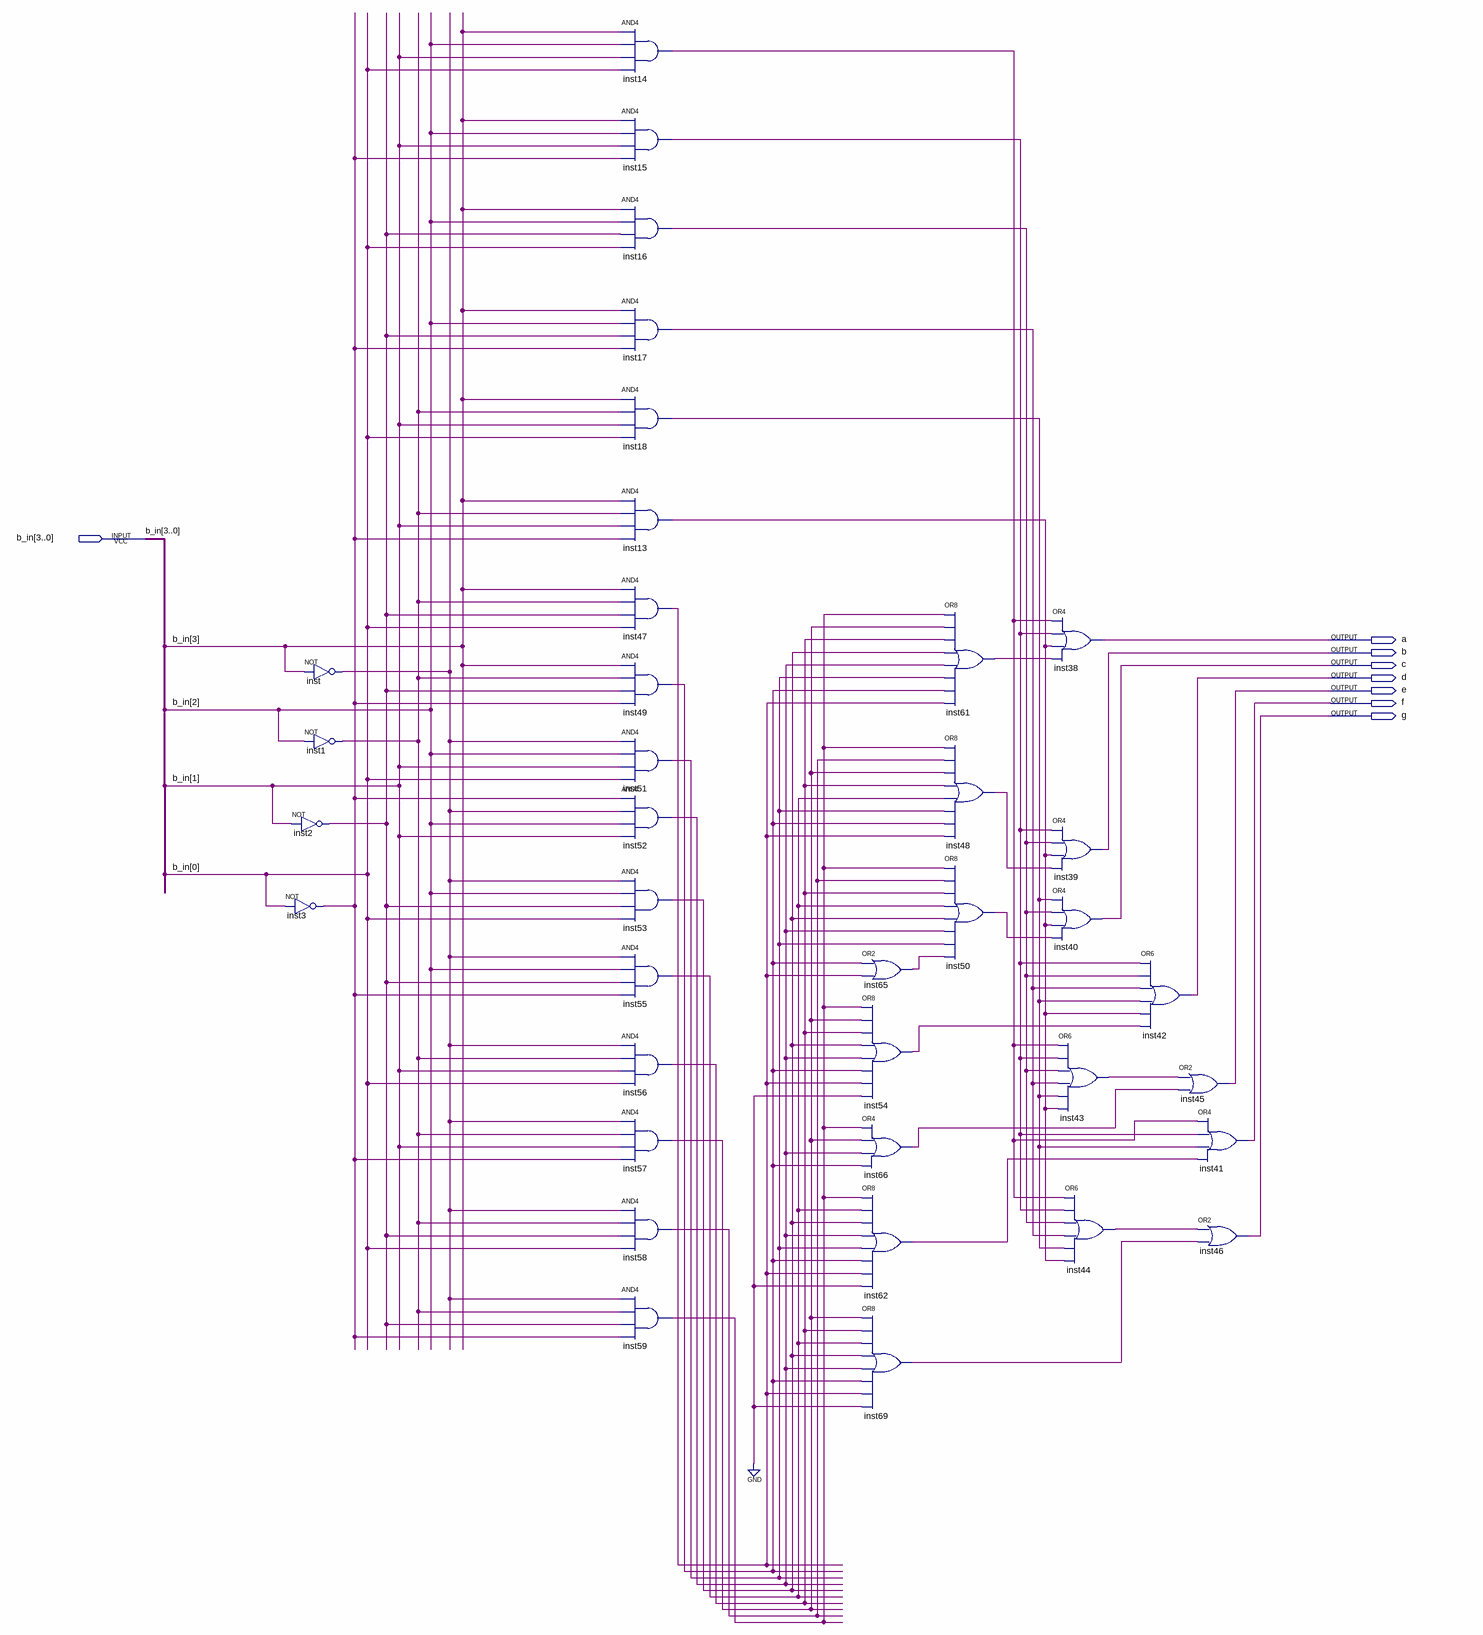
[diagram p0: schematic sheet]
// Quartus schematic b2seg_bus.bdf as structural Verilog: 37 symbols, 8 pins
module b2seg_bus (
  input  [3:0] b_in,
  output a,
  output b,
  output c,
  output d,
  output e,
  output f,
  output g
);

  wire inst1_out, inst2_out, inst3_out, inst13_out, inst14_out, inst15_out, inst16_out, inst17_out,
       inst18_out, inst43_out, inst44_out, inst47_out, inst48_out, inst49_out, inst50_out, inst51_out,
       inst52_out, inst53_out, inst54_out, inst55_out, inst56_out, inst57_out, inst58_out, inst59_out,
       inst61_out, inst62_out, inst65_out, inst66_out, inst69_out, inst_out;

  not inst (inst_out, b_in[3]);
  not inst1 (inst1_out, b_in[2]);
  not inst2 (inst2_out, b_in[1]);
  not inst3 (inst3_out, b_in[0]);
  and inst14 (inst14_out, b_in[3], b_in[2], b_in[1], b_in[0]);
  and inst15 (inst15_out, b_in[3], b_in[2], b_in[1], inst3_out);
  and inst16 (inst16_out, b_in[3], b_in[2], inst2_out, b_in[0]);
  and inst17 (inst17_out, b_in[3], b_in[2], inst2_out, inst3_out);
  and inst18 (inst18_out, b_in[3], inst1_out, b_in[1], b_in[0]);
  and inst13 (inst13_out, b_in[3], inst1_out, b_in[1], inst3_out);
  and inst47 (inst47_out, b_in[3], inst1_out, inst2_out, b_in[0]);
  and inst49 (inst49_out, b_in[3], inst1_out, inst2_out, inst3_out);
  and inst51 (inst51_out, inst_out, b_in[2], b_in[1], b_in[0]);
  and inst52 (inst52_out, inst3_out, inst_out, b_in[2], b_in[1]);
  and inst53 (inst53_out, inst_out, b_in[2], inst2_out, b_in[0]);
  and inst55 (inst55_out, inst_out, b_in[2], inst2_out, inst3_out);
  and inst56 (inst56_out, inst_out, inst1_out, b_in[1], b_in[0]);
  and inst57 (inst57_out, inst_out, inst1_out, b_in[1], inst3_out);
  and inst58 (inst58_out, inst_out, inst1_out, inst2_out, b_in[0]);
  and inst59 (inst59_out, inst_out, inst1_out, inst2_out, inst3_out);
  or inst65 (inst65_out, inst49_out, inst47_out);
  or inst54 (inst54_out, inst59_out, inst57_out, inst56_out, inst53_out, inst52_out, inst49_out, inst47_out, 1'b0);
  or inst66 (inst66_out, inst59_out, inst57_out, inst52_out, inst49_out);
  or inst62 (inst62_out, inst59_out, inst55_out, inst53_out, inst52_out, inst51_out, inst49_out, inst47_out, 1'b0);
  or inst69 (inst69_out, inst57_out, inst56_out, inst55_out, inst53_out, inst52_out, inst49_out, inst47_out, 1'b0);
  or inst61 (inst61_out, inst59_out, inst57_out, inst56_out, inst53_out, inst52_out, inst51_out, inst49_out, inst47_out);
  or inst48 (inst48_out, inst59_out, inst58_out, inst57_out, inst56_out, inst55_out, inst51_out, inst49_out, inst47_out);
  or inst50 (inst50_out, inst59_out, inst58_out, inst56_out, inst55_out, inst53_out, inst52_out, inst51_out, inst65_out);
  or inst38 (a, inst14_out, inst15_out, inst13_out, inst61_out);
  or inst39 (b, inst15_out, inst16_out, inst13_out, inst48_out);
  or inst40 (c, inst18_out, inst16_out, inst13_out, inst50_out);
  or inst43 (inst43_out, inst14_out, inst15_out, inst16_out, inst17_out, inst18_out, inst13_out);
  or inst44 (inst44_out, inst14_out, inst15_out, inst16_out, inst17_out, inst18_out, inst13_out);
  or inst42 (d, inst15_out, inst16_out, inst17_out, inst18_out, inst13_out, inst54_out);
  or inst45 (e, inst43_out, inst66_out);
  or inst41 (f, inst14_out, inst15_out, inst18_out, inst62_out);
  or inst46 (g, inst44_out, inst69_out);
endmodule
